# Altium schematic sheet [03] Display.SchDoc
size A4
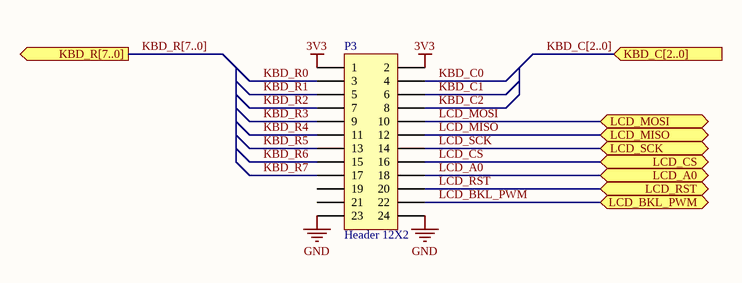
[diagram p0: [03] Display.SchDoc]

## Parts
P3  Header 12X2  [HDR2X12]

## Ports
KBD_C[2..0] (in), KBD_R[7..0] (out), LCD_A0 (bidir), LCD_BKL_PWM (bidir), LCD_CS (bidir), LCD_MISO (bidir), LCD_MOSI (bidir), LCD_RST (bidir), LCD_SCK (bidir)

## Nets
3V3: P3.1 P3.2
GND: P3.23 P3.24
KBD_C0: P3.4
KBD_C1: P3.6
KBD_C2: P3.8
KBD_R0: P3.3
KBD_R1: P3.5
KBD_R2: P3.7
KBD_R3: P3.9
KBD_R4: P3.11
KBD_R5: P3.13
KBD_R6: P3.15
KBD_R7: P3.17
LCD_A0: P3.18 ; port LCD_A0
LCD_BKL_PWM: P3.22 ; port LCD_BKL_PWM
LCD_CS: P3.16 ; port LCD_CS
LCD_MISO: P3.12 ; port LCD_MISO
LCD_MOSI: P3.10 ; port LCD_MOSI
LCD_RST: P3.20 ; port LCD_RST
LCD_SCK: P3.14 ; port LCD_SCK

Not connected (* = marked no-connect by the designer): P3 19 21

## Buses and harness runs
bus KBD_C[2..0] = port KBD_C[2..0]
bus KBD_R[7..0] = port KBD_R[7..0]

## Library data of the parts
P3 = Header 12X2: Header, 12-Pin, Dual row; LatestRevisionDate: 17-Jul-2002; LatestRevisionNote: Re-released for DXP Platform.; Publisher: Altium Limited